# Altium schematic sheet LSDWNBT-R104095001_V01.SchDoc
size A2
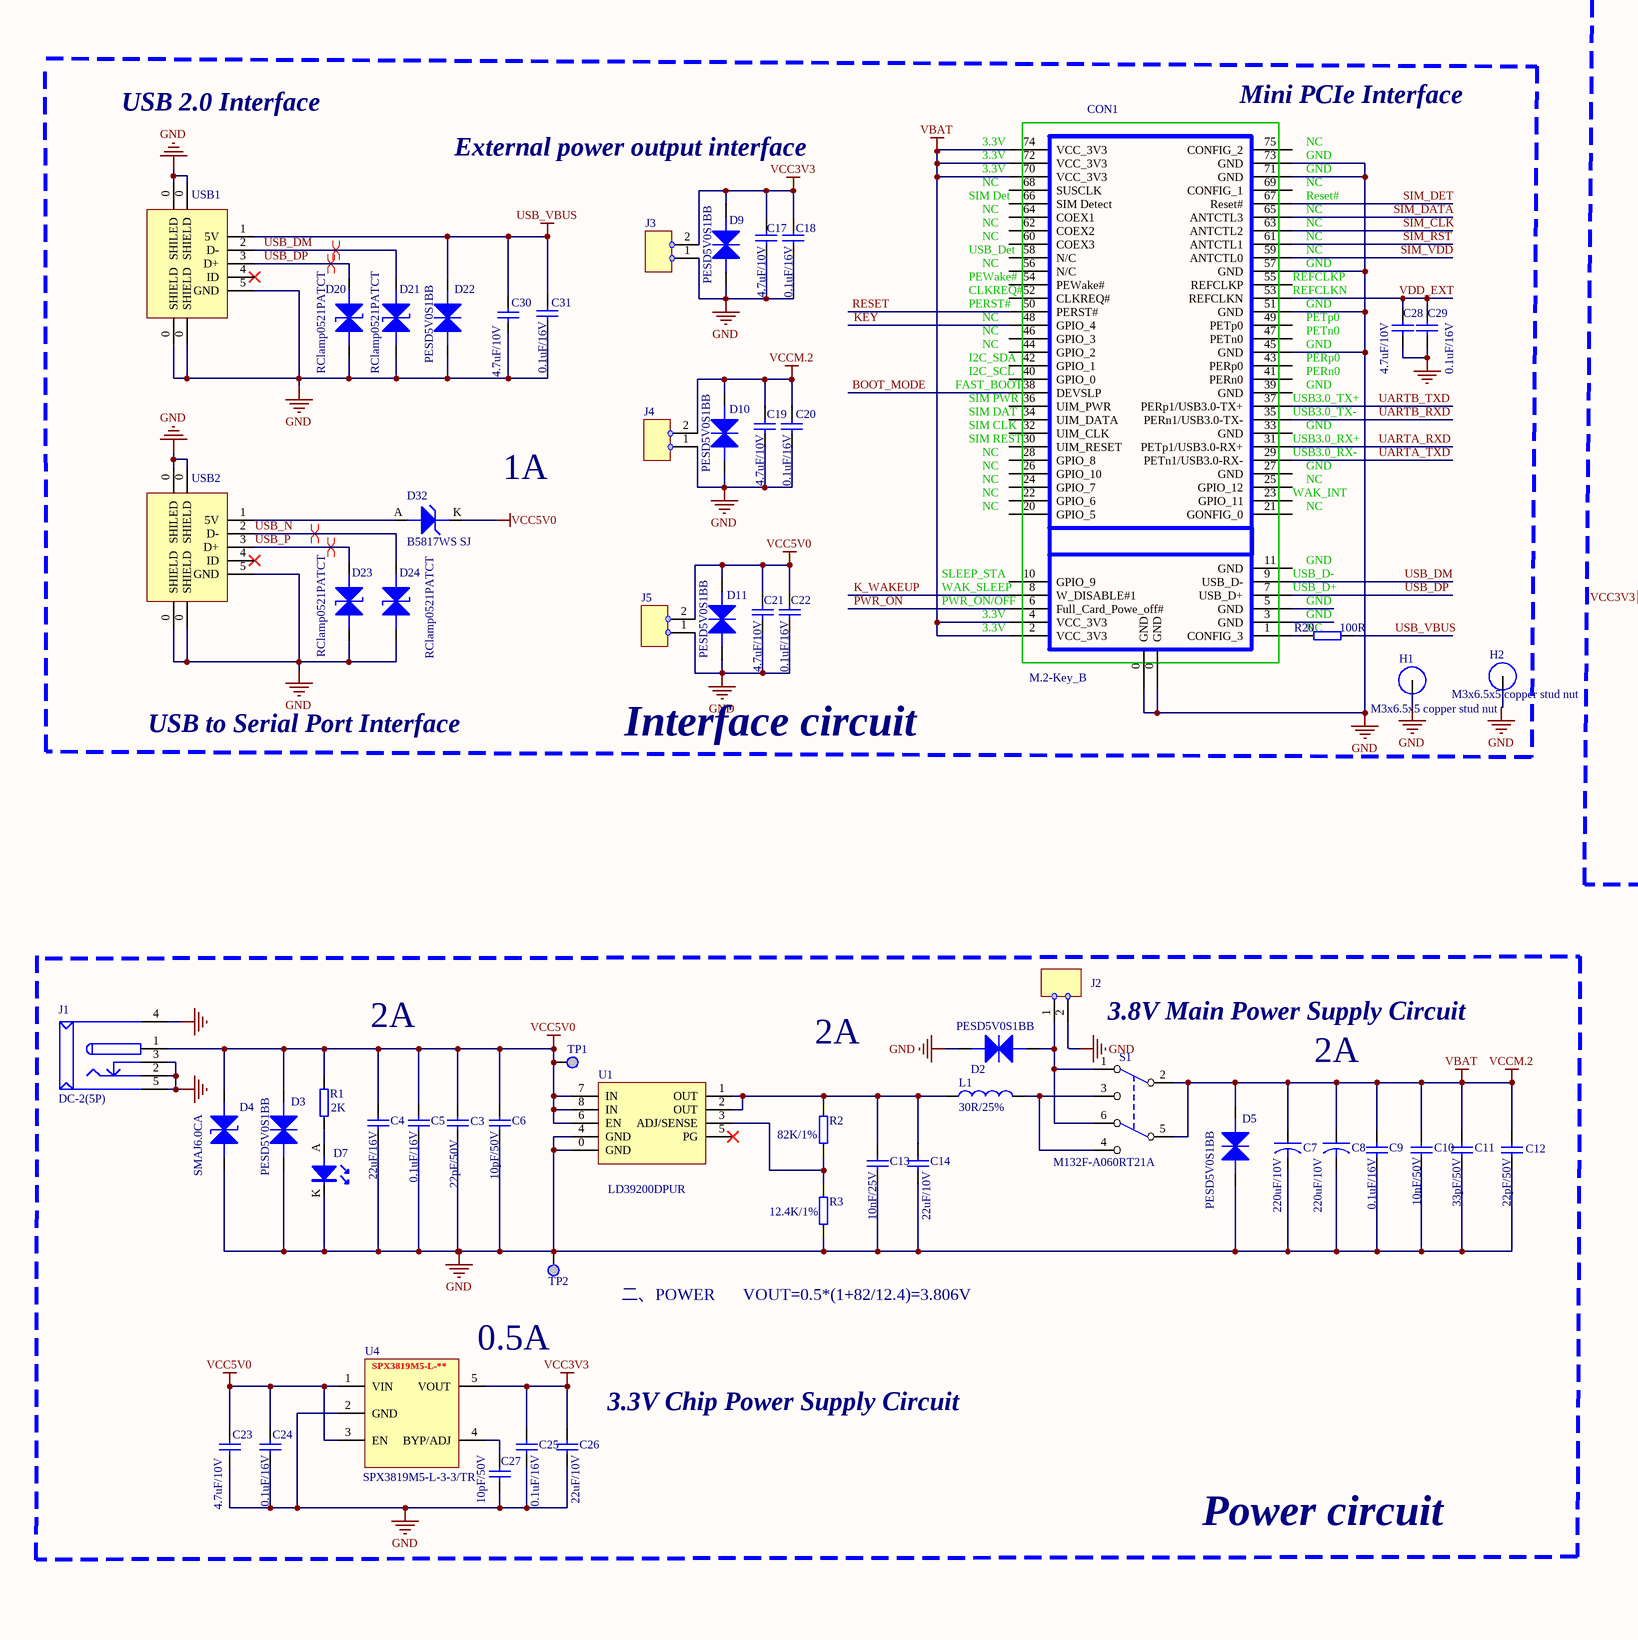
[diagram p0: LSDWNBT-R104095001_V01.SchDoc, left]
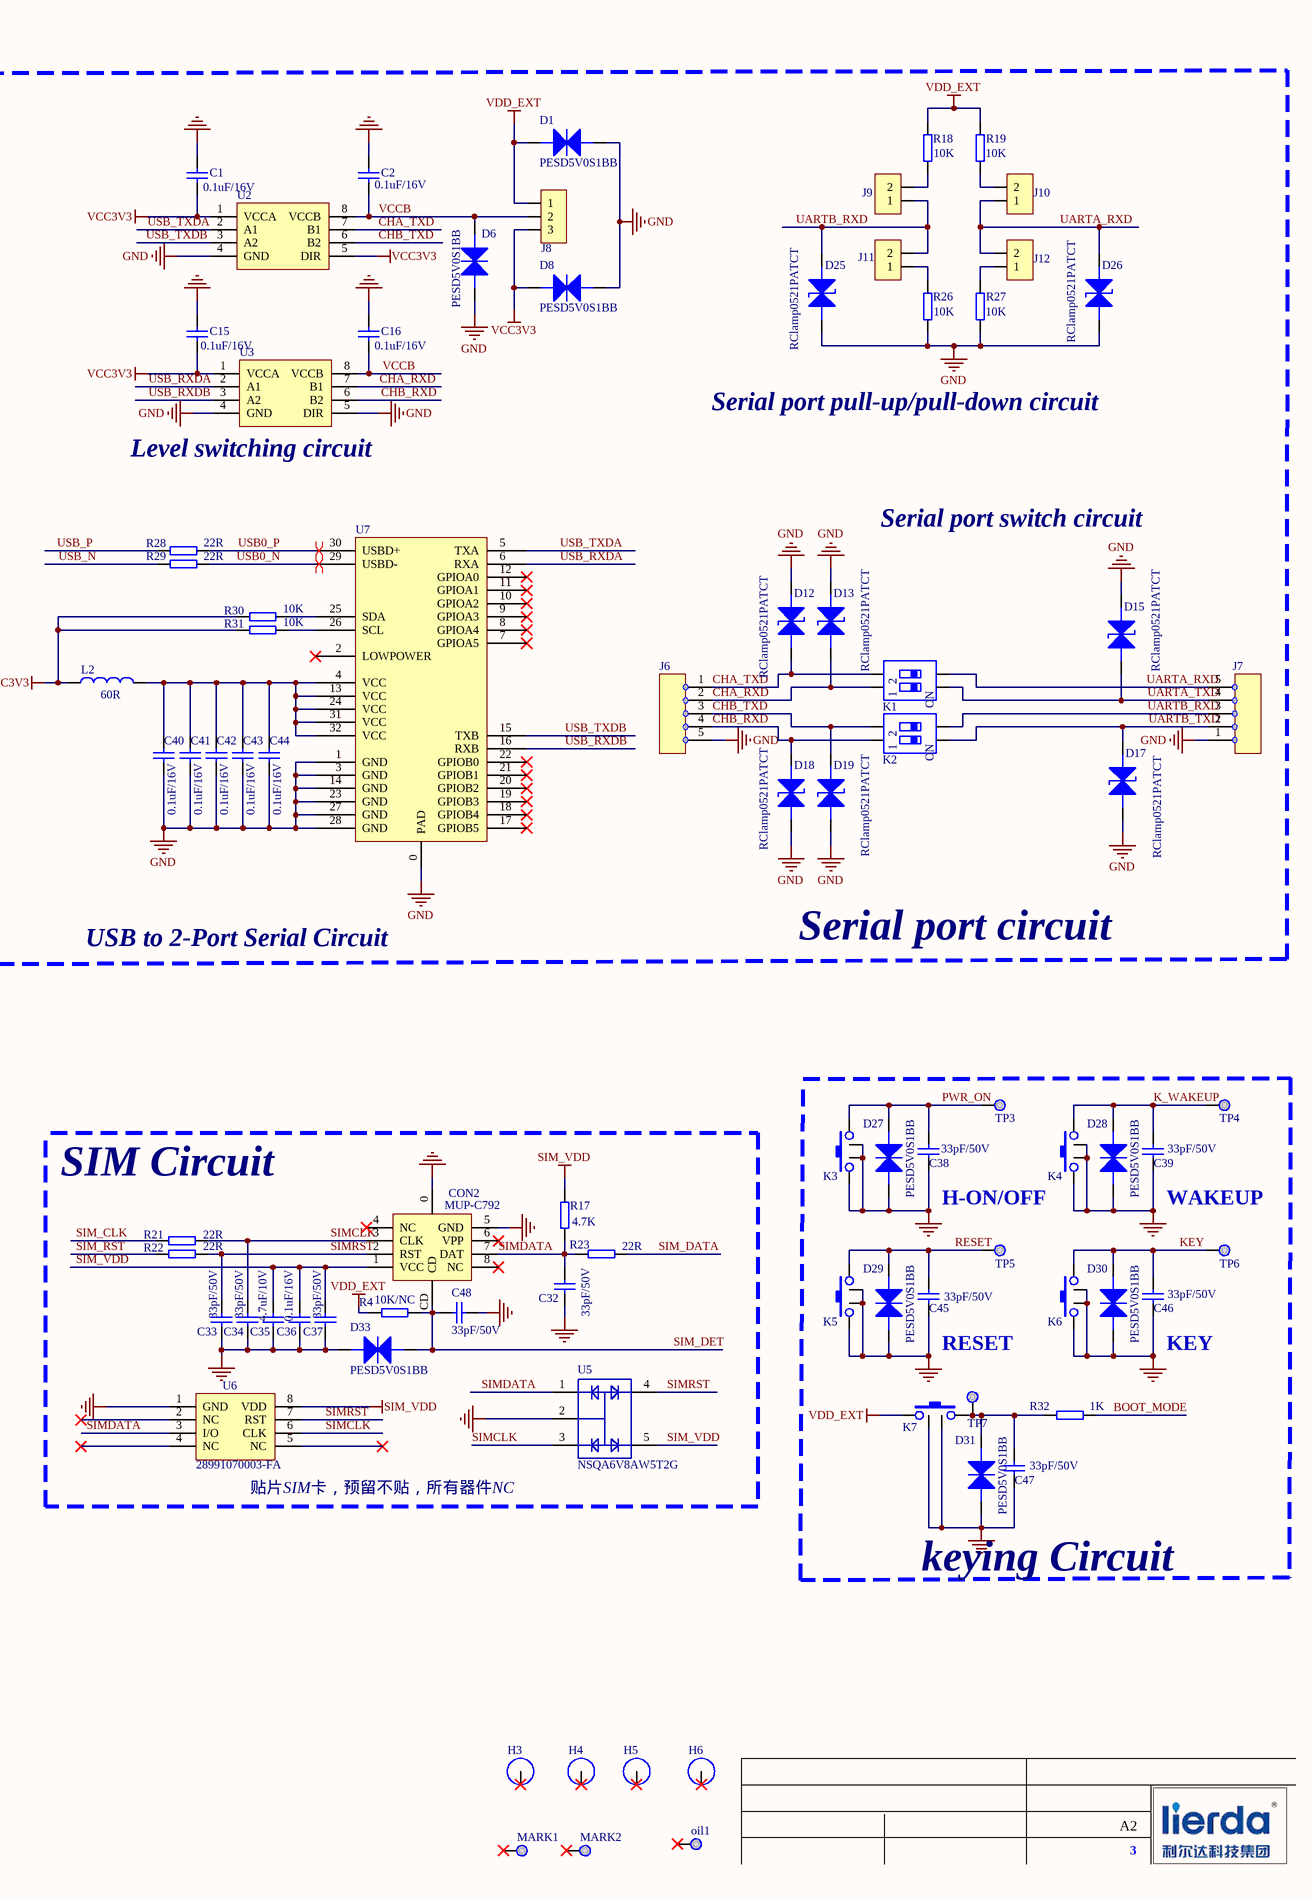
[diagram p1: LSDWNBT-R104095001_V01.SchDoc, middle]
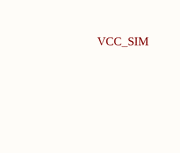
[diagram p2: LSDWNBT-R104095001_V01.SchDoc, right]

## Parts
C1  0.1uF/16V  [0402C_0.4D]
C2  0.1uF/16V  [0402C_0.4D]
C3  22pF/50V  [0402C_0.4D]
C4  22uF/16V  [0805C_0.6D]
C5  0.1uF/16V  [0402C_0.4D]
C6  10pF/50V  [0402C_0.4D]
C7  220uF/10V  [7343-TD]
C8  220uF/10V  [7343-TD]
C9  0.1uF/16V  [0402C_0.4D]
C10  10nF/50V  [0402C_0.4D]
C11  33pF/50V  [0402C_0.4D]
C12  22pF/50V  [0402C_0.4D]
C13  10nF/25V  [0402C_0.4D]
C14  22uF/10V  [0603C_0.6D]
C15  0.1uF/16V  [0402C_0.4D]
C16  0.1uF/16V  [0402C_0.4D]
C17  4.7uF/10V  [0402C_0.4D]
C18  0.1uF/16V  [0402C_0.4D]
C19  4.7uF/10V  [0402C_0.4D]
C20  0.1uF/16V  [0402C_0.4D]
C21  4.7uF/10V  [0402C_0.4D]
C22  0.1uF/16V  [0402C_0.4D]
C23  4.7uF/10V  [0402C_0.4D]
C24  0.1uF/16V  [0402C_0.4D]
C25  0.1uF/16V  [0402C_0.4D]
C26  22uF/10V  [0603C_0.6D]
C27  10pF/50V  [0402C_0.4D]
C28  4.7uF/10V  [0402C_0.4D]
C29  0.1uF/16V  [0402C_0.4D]
C30  4.7uF/10V  [0402C_0.4D]
C31  0.1uF/16V  [0402C_0.4D]
C32  33pF/50V  [0402C_0.4D]
C33  33pF/50V  [0402C_0.4D]
C34  33pF/50V  [0402C_0.4D]
C35  4.7uF/10V  [0402C_0.4D]
C36  33pF/50V  [0402C_0.4D]
C37  0.1uF/16V  [0402C_0.4D]
C38  33pF/50V  [0402C_0.4D]
C39  33pF/50V  [0402C_0.4D]
C40  0.1uF/16V  [0402C_0.4D]
C41  0.1uF/16V  [0402C_0.4D]
C42  0.1uF/16V  [0402C_0.4D]
C43  0.1uF/16V  [0402C_0.4D]
C44  0.1uF/16V  [0402C_0.4D]
C45  33pF/50V  [0402C_0.4D]
C46  33pF/50V  [0402C_0.4D]
C47  33pF/50V  [0402C_0.4D]
C48  33pF/50V  [0402C_0.4D]
CON1  M.2-Key_B  [5G卡板]
CON2  MUP-C792  [SIM-MUP-C792]
D1  产品型号: PESD5V0S1BB  [SOD-523-NP]  (hidden comment: DIODE-NP)
D2  产品型号: PESD5V0S1BB  [SOD-523-NP]  (hidden comment: DIODE-NP)
D3  产品型号: PESD5V0S1BB  [SOD-523-NP]  (hidden comment: DIODE-NP)
D4  产品型号: SMAJ6.0CA  [SMA-NP]  (hidden comment: DIODE-2TVS)
D5  产品型号: PESD5V0S1BB  [SOD-523-NP]  (hidden comment: DIODE-NP)
D6  产品型号: PESD5V0S1BB  [SOD-523-NP]  (hidden comment: DIODE-NP)
D7  DIODE-LED  [D0402]  (value not drawn)
D8  产品型号: PESD5V0S1BB  [SOD-523-NP]  (hidden comment: DIODE-NP)
D9  产品型号: PESD5V0S1BB  [SOD-523-NP]  (hidden comment: DIODE-NP)
D10  产品型号: PESD5V0S1BB  [SOD-523-NP]  (hidden comment: DIODE-NP)
D11  产品型号: PESD5V0S1BB  [SOD-523-NP]  (hidden comment: DIODE-NP)
D12  产品型号: RClamp0521PATCT  [D0402-NP]  (hidden comment: DIODE-2TVS)
D13  产品型号: RClamp0521PATCT  [D0402-NP]  (hidden comment: DIODE-2TVS)
D15  产品型号: RClamp0521PATCT  [D0402-NP]  (hidden comment: DIODE-2TVS)
D17  产品型号: RClamp0521PATCT  [D0402-NP]  (hidden comment: DIODE-2TVS)
D18  产品型号: RClamp0521PATCT  [D0402-NP]  (hidden comment: DIODE-2TVS)
D19  产品型号: RClamp0521PATCT  [D0402-NP]  (hidden comment: DIODE-2TVS)
D20  产品型号: RClamp0521PATCT  [D0402-NP]  (hidden comment: DIODE-2TVS)
D21  产品型号: RClamp0521PATCT  [D0402-NP]  (hidden comment: DIODE-2TVS)
D22  产品型号: PESD5V0S1BB  [SOD-523-NP]  (hidden comment: DIODE-NP)
D23  产品型号: RClamp0521PATCT  [D0402-NP]  (hidden comment: DIODE-2TVS)
D24  产品型号: RClamp0521PATCT  [D0402-NP]  (hidden comment: DIODE-2TVS)
D25  产品型号: RClamp0521PATCT  [D0402-NP]  (hidden comment: DIODE-2TVS)
D26  产品型号: RClamp0521PATCT  [D0402-NP]  (hidden comment: DIODE-2TVS)
D27  产品型号: PESD5V0S1BB  [SOD-523-NP]  (hidden comment: DIODE-NP)
D28  产品型号: PESD5V0S1BB  [SOD-523-NP]  (hidden comment: DIODE-NP)
D29  产品型号: PESD5V0S1BB  [SOD-523-NP]  (hidden comment: DIODE-NP)
D30  产品型号: PESD5V0S1BB  [SOD-523-NP]  (hidden comment: DIODE-NP)
D31  产品型号: PESD5V0S1BB  [SOD-523-NP]  (hidden comment: DIODE-NP)
D32  产品型号: B5817WS SJ  [SOD-323(UMD2_SC-90-A)]  (hidden comment: DIODE-ZD)
D33  产品型号: PESD5V0S1BB  [SOD-523-NP]  (hidden comment: DIODE-NP)
H1  产品型号: M3x6.5x5 copper stud nut  [HOLD_SMTM3x6.5x5]  (hidden comment: HOLE)
H2  产品型号: M3x6.5x5 copper stud nut  [HOLD_SMTM3x6.5x5]  (hidden comment: HOLE)
H3  HOLE  [M3-3 unplated]  (value not drawn)
H4  HOLE  [M3-3 unplated]  (value not drawn)
H5  HOLE  [M3-3 unplated]  (value not drawn)
H6  HOLE  [M3-3 unplated]  (value not drawn)
J1  DC-2(5P)  [POWER SOKET 5.5-5]
J2  SPI 2-F  [SIP 2.54_2_S]  (value not drawn)
J3  SPI 2-F  [SIP 2.54_2_S]  (value not drawn)
J4  SPI 2-F  [SIP 2.54_2_S]  (value not drawn)
J5  SPI 2-F  [SIP 2.54_2_S]  (value not drawn)
J6  SPI 5-F  [SIP 2.54_5_S]  (value not drawn)
J7  SPI 5-F  [SIP 2.54_5_S]  (value not drawn)
J8  SPI 3-M  [SIP 2.54_3_S]  (value not drawn)
J9  SPI 2-M  [SIP 2.54_2_S]  (value not drawn)
J10  SPI 2-M  [SIP 2.54_2_S]  (value not drawn)
J11  SPI 2-M  [SIP 2.54_2_S]  (value not drawn)
J12  SPI 2-M  [SIP 2.54_2_S]  (value not drawn)
K1  SWITCH-2  [SWD-2.54-DIP4]  (value not drawn)
K2  SWITCH-2  [SWD-2.54-DIP4]  (value not drawn)
K3  BUTTON-2-2  [SW-7.8X3.5-4P-HOLE-S]  (value not drawn)
K4  BUTTON-2-2  [SW-7.8X3.5-4P-HOLE-S]  (value not drawn)
K5  BUTTON-2-2  [SW-7.8X3.5-4P-HOLE-S]  (value not drawn)
K6  BUTTON-2-2  [SW-7.8X3.5-4P-HOLE-S]  (value not drawn)
K7  BUTTON-2-2  [SW-7.8X3.5-4P-HOLE-S]  (value not drawn)
L1  30R/25%  [0603L_0.6D]
L2  60R  [0603L_0.6D]
MARK1  MARK  [MARK]  (value not drawn)
MARK2  MARK  [Bad Mark]  (value not drawn)
oil1  TP  [White oil-6X6]  (value not drawn)
R1  2K  [0402R_0.4D]
R2  82K/1%  [0402R_0.4D]
R3  12.4K/1%  [0603R_0.6D]
R4  10K/NC  [0402R_0.4D]
R17  4.7K  [0402R_0.4D]
R18  10K  [0402R_0.4D]
R19  10K  [0402R_0.4D]
R20  100R  [0402R_0.4D]
R21  22R  [0402R_0.4D]
R22  22R  [0402R_0.4D]
R23  22R  [0402R_0.4D]
R26  10K  [0402R_0.4D]
R27  10K  [0402R_0.4D]
R28  22R  [0402R_0.4D]
R29  22R  [0402R_0.4D]
R30  10K  [0402R_0.4D]
R31  10K  [0402R_0.4D]
R32  1K  [0402R_0.4D]
S1  产品型号: M132F-A060RT21A  [SW-7X12.6-6P-D]  (hidden comment: SWITCH-DPDT)
TP1  (no value)  [TEST]
TP2  (no value)  [TEST]
TP3  ACC_DET  [TEST]  (value not drawn)
TP4  ACC_DET  [TEST]  (value not drawn)
TP5  ACC_DET  [TEST]  (value not drawn)
TP6  ACC_DET  [TEST]  (value not drawn)
TP7  ACC_DET  [TEST]  (value not drawn)
U1  LD39200DPUR  [DFN8(0.8)-4X4]
U2  SN74AVC2T45DCUT  [VSSOP-8(0.5)-2X2.3]  (value not drawn)
U3  SN74AVC2T45DCUT  [VSSOP-8(0.5)-2X2.3]  (value not drawn)
U4  产品型号: SPX3819M5-L-3-3/TR  [SOT-23-5P]  (hidden comment: SPX3819M5-L)
U5  NSQA6V8AW5T2G  [SOT-323-5]
U6  型号: 28991070003-FA  [DFN8(1.27)-6X5]  (hidden comment: 180006-03G)
U7  XR21V1412IL32  [QFN32(0.5)-5X5]  (value not drawn)
USB1  USB2.0  [USB-MICRO-2-1]  (value not drawn)
USB2  USB To UART  [USB-MICRO-2-1]  (value not drawn)

## Blocks framed on the sheet
Serial port circuit: C1 C2 C15 C16 C40-C44 D1 D6 D8 D12 D13 D15 D17-D19 D25 D26 J6-J12 K1 K2 L2 R18 R19 R26-R31 U2 U3 U7
keying Circuit: C38 C39 C45-C47 D27-D31 K3-K7 R32 TP3-TP7

## Nets
GND: C1.1 C2.1 C3.1 C4.1 C5.2 C6.1 C7.2 C8.2 C9.2 C10.1 C11.1 C12.1 C13.1 C14.1 C15.1 C16.1 C17.1 C18.2 C19.1 C20.2 C21.1 C22.2 C23.1 C24.2 C25.2 C26.1 C27.1 C28.1 C29.2 C30.1 C31.2 C32.1 C33.1 C34.1 C35.1 C36.1 C37.2 C38.1 C39.1 C40.2 C41.2 C42.2 C43.2 C44.2 C45.1 C46.1 C47.1 C48.1 CON1.0(GND) CON1.45(GND) CON1.51(GND) CON1.57(GND) CON1.71(GND) CON1.73(GND) CON2.0 CON2.5(GND) D1.A D2.K D3.A D4.A D5.A D6.A D7.K D8.A D9.A D10.A D11.A D12.A D13.A D15.A D17.K D18.K D19.K D20.K D21.K D22.A D23.K D24.K D25.K D26.K D27.A D28.A D29.A D30.A D31.A D33.K H1.1(H) H2.1(H) J1.2 J1.3 J1.4 J1.5 J2.2 J3.1 J4.1 J5.1 J6.5 J7.1 K3.0 K3.1 K4.0 K4.1 K5.0 K5.1 K6.0 K6.1 K7.0 R3.1 R26.1 R27.1 TP2.1 U1.0(GND) U1.4(GND) U2.4(GND) U3.4(GND) U3.5(DIR) U4.2(GND) U5.2 U6.1(GND) U7.0(PAD) U7.1(GND) U7.3(GND) U7.14(GND) U7.23(GND) U7.27(GND) U7.28(GND) USB1.0(SHIELD) USB1.5(GND) USB2.0(SHIELD) USB2.5(GND)
SIM_VDD: C35.2 C36.2 C37.1 CON1.59(ANTCTL0) CON2.1(VCC) R17.2 U5.5 U6.8(VDD)
USB_VBUS: C30.2 C31.1 D22.K R20.2 USB1.1(5V)
VBAT: C7.1 C8.1 C9.1 C10.2 C11.2 C12.2 C19.2 C20.1 CON1.2(VCC_3V3) CON1.4(VCC_3V3) CON1.70(VCC_3V3) CON1.72(VCC_3V3) CON1.74(VCC_3V3) D5.K D10.K J4.2 S1.2(COMMON1) S1.5(COMMON2)  [also labelled VCCM.2]
VCC3V3: C1.2 C15.2 C17.2 C18.1 C25.1 C26.2 D8.K D9.K J3.2 J8.3 L2.1 R30.1 R31.1 U2.1(VCCA) U2.5(DIR) U3.1(VCCA) U4.5(VOUT)
VCC5V0: C3.2 C4.2 C5.1 C6.2 C21.2 C22.1 C23.2 C24.1 D3.K D4.K D11.K D32.K J1.1 J5.2 R1.2 TP1.1 U1.6(EN) U1.7(IN) U1.8(IN) U4.1(VIN) U4.3(EN)
VDD_EXT: C28.2 C29.1 CON1.53(REFCLKN) D1.K J8.1 K7.1 R4.2 R18.2 R19.2
BOOT_MODE: CON1.38(DEVSLP) R32.2
CHA_RXD: D13.K J6.2 K1.1 U3.7(B1)
CHA_TXD: D12.K J6.1 K1.2 U2.7(B1)
CHB_RXD: D18.A J6.4 K2.1 U3.6(B2)
CHB_TXD: D19.A J6.3 K2.2 U2.6(B2)
K_WAKEUP: C39.2 CON1.8(W_DISABLE#1) D28.K K4.2 TP4.1
KEY: C46.2 CON1.48(GPIO_4) D30.K K6.2 TP6.1
PWR_ON: C38.2 CON1.6(Full_Card_Powe_off#) D27.K K3.2 TP3.1
RESET: C45.2 CON1.50(PERST#) D29.K K5.2 TP5.1
SIM_CLK: CON1.63(ANTCTL2) R21.1
SIM_DATA: CON1.65(ANTCTL3) R23.2
SIM_DET: C48.2 CON1.67(Reset#) CON2.CD D33.A R4.1
SIM_RST: CON1.61(ANTCTL1) R22.1
SIMCLK: C34.2 CON2.3(CLK) R21.2 U5.3 U6.6(CLK)
SIMDATA: C32.2 CON2.7(DAT) R17.1 R23.1 U5.1 U6.3(I/O)
SIMRST: C33.2 CON2.2(RST) R22.2 U5.4 U6.7(RST)
UARTA_RXD: CON1.31(PETp1/USB3.0-RX+) D26.A J7.5 J10.1 J12.2 K1.3
UARTA_TXD: CON1.29(PETn1/USB3.0-RX-) D15.K J7.4 K1.4
UARTB_RXD: CON1.35(PERn1/USB3.0-TX-) D25.A J7.3 J9.1 J11.2 K2.3
UARTB_TXD: CON1.37(PERp1/USB3.0-TX+) D17.A J7.2 K2.4
USB0_N: R29.2 U7.29(USBD-)
USB0_P: R28.2 U7.30(USBD+)
USB_DM: CON1.9(USB_D-) D21.A USB1.2(D-)
USB_DP: CON1.7(USB_D+) D20.A USB1.3(D+)
USB_N: D24.A R29.1 USB2.2(D-)
USB_P: D23.A R28.1 USB2.3(D+)
USB_RXDA: U3.2(A1) U7.6(RXA)
USB_RXDB: U3.3(A2) U7.16(RXB)
USB_TXDA: U2.2(A1) U7.5(TXA)
USB_TXDB: U2.3(A2) U7.15(TXB)
VCCB: C2.2 C16.2 D6.K J8.2 U2.8(VCCB) U3.8(VCCB)
NetC13_2: C13.2 C14.2 L1.1 R2.2 U1.1(OUT) U1.2(OUT)
NetC27_2: C27.2 U4.4(BYP/ADJ)
NetC40_1: C40.1 C41.1 C42.1 C43.1 C44.1 L2.2 U7.4(VCC) U7.13(VCC) U7.24(VCC) U7.31(VCC) U7.32(VCC)
NetC47_2: C47.2 D31.K K7.2 R32.1 TP7.1
NetCON1_1: CON1.1(CONFIG_3) R20.1
NetD2_A: D2.A J2.1 S1.1(NC1) S1.6(NC2)
NetD7_A: D7.A R1.1
NetD32_A: D32.A USB2.1(5V)
NetJ9_2: J9.2 R18.1
NetJ10_2: J10.2 R19.1
NetJ11_1: J11.1 R26.2
NetJ12_1: J12.1 R27.2
NetL1_2: L1.2 S1.3(NO1) S1.4(NO2)
NetR2_1: R2.1 R3.2 U1.3(ADJ/SENSE)
NetR30_2: R30.2 U7.25(SDA)
NetR31_2: R31.2 U7.26(SCL)

Not connected (* = marked no-connect by the designer): CON1 3(GND) 5(GND) 10(GPIO_9) 11(GND) 20(GPIO_5) 21(GONFIG_0) 22(GPIO_6) 23(GPIO_11) 24(GPIO_7) 25(GPIO_12) 26(GPIO_10) 27(GND) 28(GPIO_8) 30(UIM_RESET) 32(UIM_CLK) 33(GND) 34(UIM_DATA) 36(UIM_PWR) 39(GND) 40(GPIO_0) 41(PERn0) 42(GPIO_1) 43(PERp0) 44(GPIO_2) 46(GPIO_3) 47(PETn0) 49(PETp0) 52(CLKREQ#) 54(PEWake#) 55(REFCLKP) 56(N/C) 58(N/C) 60(COEX3) 62(COEX2) 64(COEX1) 66(SIM_Detect) 68(SUSCLK) 69(CONFIG_1) 75(CONFIG_2); CON2 4(NC)* 6(VPP)* 8(NC)*; H3 1(H)*; H4 1(H)*; H5 1(H)*; H6 1(H)*; MARK1 1*; MARK2 1*; oil1 1*; U1 5(PG)*; U6 2(NC)* 4(NC)* 5(NC)*; U7 2(LOWPOWER)* 7(GPIOA5)* 8(GPIOA4)* 9(GPIOA3)* 10(GPIOA2)* 11(GPIOA1)* 12(GPIOA0)* 17(GPIOB5)* 18(GPIOB4)* 19(GPIOB3)* 20(GPIOB2)* 21(GPIOB1)* 22(GPIOB0)*; USB1 4(ID)*; USB2 4(ID)*

## Layout directives
differential pair: USB0_N, USB0_P, USB_DM, USB_DP, USB_N, USB_P

## Notes on the sheet
- USB 2.0 Interface
- (near CON1) Mini PCIe Interface
- External power output interface
- Serial port pull-up/pull-down circuit
- (near U3) Level switching circuit
- Serial port switch circuit
- 1A
- USB to Serial Port Interface
- Interface circuit
- USB to 2-Port Serial Circuit
- 2A
- 3.8V Main Power Supply Circuit
- SIM Circuit
- H-ON/OFF
- WAKEUP
- 二、POWER
- VOUT=0.5*(1+82/12.4)=3.806V
- RESET
- (near C46) KEY
- (near U4) 0.5A
- (near C26) 3.3V Chip Power Supply Circuit
- (near U6) 贴片SIM卡，预留不贴，所有器件NC
- Power circuit
- A2
- 3
- Labels drawn without touching a wire or pin: VCC_SIM
- (in symbol 1410000645) SPX3819M5-L-**
- (in symbol 1414000303) ON
- (in symbol Mechanical Key B) 3.3V; NC; SIM Det; USB_Det; I2C_SDA; I2C_SCL; FAST_BOOT; SIM PWR; USB3.0_TX+; SIM DAT; USB3.0_TX-; SIM CLK; SIM REST; USB3.0_RX+; USB3.0_RX-; WAK_INT; SLEEP_STA; WAK_SLEEP; PWR_ON/OFF

## Library data of the parts
C1 C2 C5 C9 C15 C16 C18 C20 C22 C24 C25 C29 C31 C37 C40-C44 = 1405000464: 0.1uF/16V/10%/X7R; 产品型号: CL05B104KO5NNNC; 器件名称: 陶瓷电容; 原厂品牌: SAMSUNG电容; 封装: 0402; Value: 0.1uF; 存货编码: 1405000464
C3 C12 = 1405001320: 22pF/50V/5%/C0G; 产品型号: C0402C0G220J500N#B; 器件名称: 陶瓷电容; 原厂品牌: 宇阳; 封装: 0402; 存货编码: 1405001320
C4 = 1405004158: 22uF/16V/20%/X5R; 产品型号: CL21A226MOQNNNE; 器件名称: 陶瓷电容; 原厂品牌: SAMSUNG电容; 封装: 0805; 存货编码: 1405004158
C6 C27 = 1405001281: 10pF/50V/5%/C0G; 产品型号: C0402C0G100J500N#B; 器件名称: 陶瓷电容; 原厂品牌: 宇阳; 封装: 0402; 存货编码: 1405001281
C7 C8 = 1405002058: 220uF/10V/10%; 产品型号: TPSD227K010R0150; 器件名称: 钽电容; 原厂品牌: AVX; 封装: D型; 存货编码: 1405002058
C10 = 1405002139: 10nF/50V/5%/X7R; 产品型号: CC0402JRX7R9BB103; 器件名称: 陶瓷电容; 原厂品牌: YAGEO; 封装: 0402; 存货编码: 1405002139
C11 C32-C34 C36 C38 C39 C45-C48 = 1405001380: 33pF/50V/5%/C0G; 产品型号: C0402C0G330J500N#B; 器件名称: 陶瓷电容; 原厂品牌: EYANG宇阳(微容VIIYONG); 封装: 0402; 存货编码: 1405001380
C13 = 1405000727: 10nF/25V/10%/X7R; 产品型号: GRM155R71E103KA01D; 器件名称: 陶瓷电容; 原厂品牌: MURATA; 封装: 0402; 存货编码: 1405000727
C14 C26 = 1405001346: 22uF/10V/20%/X5R; 产品型号: CL10A226MP8NUN#; 器件名称: 陶瓷电容; 原厂品牌: SAMSUNG电容; 封装: 0603; 存货编码: 1405001346
C17 C19 C21 C23 C28 C30 C35 = 1405001598: 4.7uF/10V/10%/X5R; 产品型号: GRM155R61A475KEAA#; 器件名称: 陶瓷电容; 原厂品牌: MURATA; 封装: 0402; 存货编码: 1405001598
CON1 = Mechanical Key B
CON2 = 1416000693: MICRO SIM卡座/推拉式/1.5mm; 器件名称: SIM卡座; 原厂品牌: 德海威; 封装: SMD; 产品型号: MUP-C792; 存货编码: 1416000693
D1 D3 D6 D8-D11 D22 = 1409000207: ESD保护/双向; 器件名称: 二极管; 原厂品牌: NXP; 封装: SOD523; 存货编码: 1409000207
D2 D5 D27-D31 D33 = 1409000207: ESD保护/双向; 器件名称: 二极管; 原厂品牌: Nexperia; 封装: SOD523; 存货编码: 1409000207
D4 = 1409002936: 双向/6V/400W; 器件名称: TVS管; 原厂品牌: 捷捷微; 封装: SMA; 存货编码: 1409002936
D7 = 1409000384: 红/25mA; 产品型号: LED; 器件名称: 发光二极管; 原厂品牌: EVERLIGHT; 封装: 0402; 存货编码: 1409000384
D12 D13 D15 D17-D21 D23-D26 = 1409000820: 双向/15KV/100W; 器件名称: TVS管; 原厂品牌: SEMTECH; 封装: SMD; 存货编码: 1409000820
D32 = 1409000398: 20V/1A; 器件名称: 肖特基二极管; 原厂品牌: CJ; 封装: SOD-323; 存货编码: 1409000398
H1 H2 = 1602002589: 品名: 螺柱; 原厂品牌: 磊森晶通信; 封装: 其他; 存货编码: 1602002589
H3-H6 = HOLE: 定位孔; 产品型号: HOLE
J1 = 1416000675: DC JACK; 产品型号: DC44H-A2060RJ03A; 器件名称: DC电源插座; 原厂品牌: 福大电子; 封装: DIP; 存货编码: 1416000675
J2-J5 = 1416001592: 2.54/1*2P/单排/直; 产品型号: CNT-M254-1*2-GS-6/3-01; 存货编码: 1416001240; 器件名称: 排母; 原厂品牌: 肯耐特; 封装: DIP
J6 J7 = 1416001594: 2.54/1*5P/单排/直; 产品型号: CNT-M254-1*5-GS-6/3-01; 存货编码: 1416002038; 器件名称: 排母; 原厂品牌: 肯耐特; 封装: DIP
J8 = 1416000824: 2.54mm/单排/3PIN/直; 产品型号: PH2.54排针1*3P/L=11.6PA=6.0PC=3.0H=2.5/reach; 器件名称: 排针; 原厂品牌: 联益; 封装: DIP; 存货编码: 1416000824
J9-J12 = 1416000913: 2.54mm/单排/1*2PIN/直; 产品型号: 313102S1411; 器件名称: 排针; 原厂品牌: 联益; 封装: DIP; 存货编码: 1416000913
K1 K2 = 1414000303: 产品型号: KF1001-02P-R0-FS-ON-01B; 器件名称: 拨码开关; 原厂品牌: 凯峰; 封装: DIP; 存货编码: 1414000303
K3-K7 = 1414000107: 单颗侧键/带定位柱; 产品型号: 1188E-1W2-V-T/R; 器件名称: 轻触开关; 原厂品牌: DIPTRONICS; 封装: SMD; 存货编码: 1414000107
L1 = 1404000895: 30R/25%/5A; 产品型号: MPZ1608S300A; 器件名称: 磁珠; 原厂品牌: TDK; 封装: 0603; 存货编码: 1404000895
L2 = 1404000018: 60R/25%/2.0A/铁氧体; 产品型号: PZ1608U600-2R0TF; 器件名称: 磁珠; 原厂品牌: Sunlord; 封装: 0603; 存货编码: 1404000018
oil1 = TP: 产品型号: oil
R1 = 1408000223: 2K/5%/100PPM; 产品型号: RJ0402-2K; 器件名称: 电阻; 原厂品牌: Uniohm; 封装: 0402; 存货编码: 1408000223
R2 = 1408002313: 82K/1%/100PPM; 产品型号: RF0402-82K; 器件名称: 厚膜贴片电阻; 原厂品牌: Uniohm; 封装: 0402; 存货编码: 1408002313
R3 = 1408000903: 12.4K/1%/100PPM; 产品型号: RC0603FR-0712K4L; 器件名称: 厚膜贴片电阻; 原厂品牌: YAGEO; 封装: 0603; 存货编码: 1408000903
R4 R18 R19 R26 R27 R30 R31 = 1408000158: 10K/5%/100PPM; 产品型号: RC0402JR-0710KL; 器件名称: 电阻; 原厂品牌: YAGEO; 封装: 0402; 存货编码: 1408000158
R17 = 1408000467: 4.7K/5%/100PPM; 产品型号: RC0402JR-074K7L; 器件名称: 电阻; 原厂品牌: YAGEO; 封装: 0402; 存货编码: 1408000467
R20 = 1408000157: 100R/5%/100PPM; 产品型号: RJ0402-100R; 器件名称: 厚膜贴片电阻; 原厂品牌: Uniohm; 封装: 0402; 存货编码: 1408000157
R21-R23 = 1408001926: 22R/5%; 产品型号: RJ0402-22R; 器件名称: 厚膜贴片电阻; 原厂品牌: Uniohm; 封装: 0402; 存货编码: 1408001926
R28 R29 = 1408001926: 22R/5%/200PPM; 产品型号: RJ0402-22R; 器件名称: 电阻; 原厂品牌: Uniohm; 封装: 0402; 存货编码: 1408001926
R32 = 1408000535: 1K/5%/100PPM; 产品型号: RJ0402-1K; 器件名称: 厚膜贴片电阻; 原厂品牌: Uniohm; 封装: 0402; 存货编码: 1408000535
S1 = 1414000154: 器件名称: 拨动开关; 原厂品牌: 福大电子; 封装: 其他; 存货编码: 1414000154
TP1 TP2 = P
TP3-TP7 = TP
U1 = 1407000361: 器件名称: 电源管理芯片; 原厂品牌: ST; 封装: DFN8; 产品型号: LD39200DPUR; 存货编码: 1407000361
U2 U3 = 1410009108: 器件名称: 集成电路; 原厂品牌: Nexperia; 封装: VSSOP8; 存货编码: 1410009108
U4 = 1410000645: 3.3V/500mA; 器件名称: LDO; 原厂品牌: EXAR; 封装: SOT-23-5; 存货编码: 1410000645
U5 = 1409000217: 双向/7.14V/600W; 器件名称: TVS管; 原厂品牌: Onsemi; 产品型号: NSQA6V8AW5T2G; 存货编码: 1409000217; 封装: SOT-323-5
U6 = 180006-03G: 存货编码: 1410013522; 封装: MFF2; 品牌: 不指定（客供料）
U7 = 1410008750: USB Interface IC 2-Ch 12Mbps 48MHz Internal clock, UART; 产品型号: XR21V1412IL32TR-F; 器件名称: 集成电路; 原厂品牌: EXAR; 封装: QFN32; 存货编码: 1410008750
USB1 USB2 = 1416000333: USB，Right Angle; 产品型号: UJ05H20-02HA1RC37B; 器件名称: 插座; 原厂品牌: 福大电子; 封装: SMD; 存货编码: 1416000333
MARK1 MARK2 = MARK: 产品型号: MARK